# Altium schematic sheet Microcontroller.SchDoc
size A
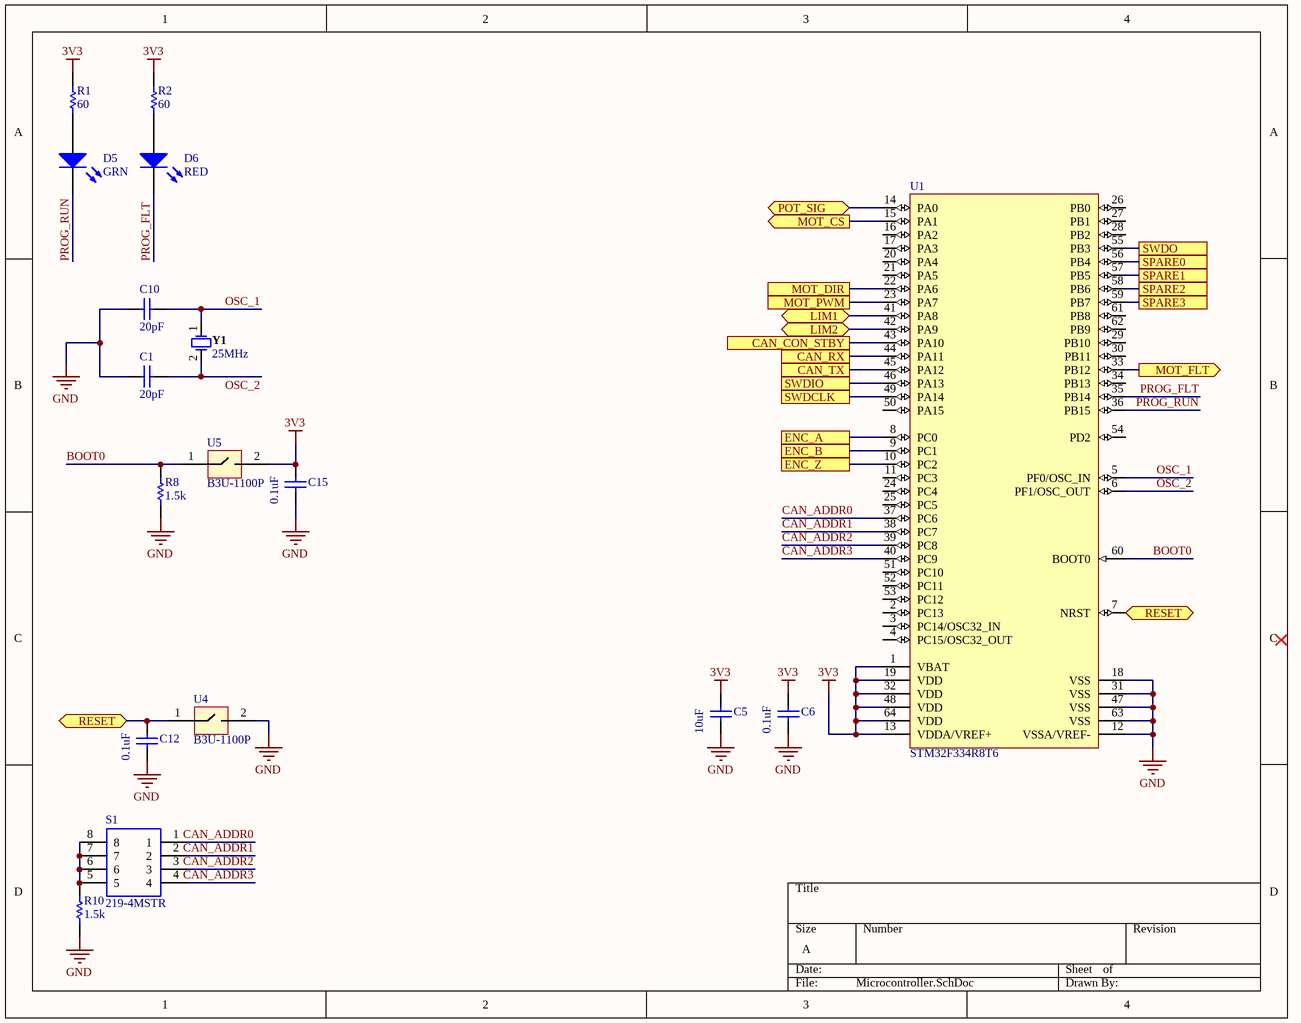
[diagram p0: Microcontroller.SchDoc]

## Parts
C1  value 20pF  [RESC2013X60X35LL10T20]  (hidden comment: Cap Semi)
C5  value 10uF  [RESC2013X60X35LL10T20]  (hidden comment: Cap Semi)
C6  value 0.1uF  [RESC2013X60X35LL10T20]  (hidden comment: Cap Semi)
C10  value 20pF  [RESC2013X60X35LL10T20]  (hidden comment: Cap Semi)
C12  value 0.1uF  [RESC2013X60X35LL10T20]  (hidden comment: Cap Semi)
C15  value 0.1uF  [RESC2013X60X35LL10T20]  (hidden comment: Cap Semi)
D5  GRN  [LED]
D6  RED  [LED]
R1  60  [RESC2013X60X35LL10T20]
R2  60  [RESC2013X60X35LL10T20]
R8  1.5k  [RESC2013X60X35LL10T20]
R10  1.5k  [RESC2013X60X35LL10T20]
S1  219-4MSTR  [SOP254P991X385-8N]
U1  STM32F334R8T6  [STM-LQFP64_L]
U4  B3U-1100P  [B3U-1100P - duplicate]
U5  B3U-1100P  [B3U-1100P - duplicate]
Y1  25MHz  [ADAI-THHF-49S3]

## Ports
CAN_CON_STBY, CAN_RX, CAN_TX, ENC_A, ENC_B, ENC_Z, LIM1 (bidir), LIM2 (bidir), MOT_CS (out), MOT_DIR, MOT_FLT (out), MOT_PWM, POT_SIG (bidir), RESET (bidir), SPARE0, SPARE1, SPARE2, SPARE3, SWDCLK, SWDIO, SWDO

## Nets
3V3: C5.2 C6.2 C15.2 R1.2 R2.2 U1.1(VBAT) U1.13(VDDA/VREF+) U1.19(VDD) U1.32(VDD) U1.48(VDD) U1.64(VDD) U5.2(NO_PUSH)
GND: C1.2 C5.1 C6.1 C10.2 C12.1 C15.1 R8.1 R10.1 U1.12(VSSA/VREF-) U1.18(VSS) U1.31(VSS) U1.47(VSS) U1.63(VSS) U4.2(NO_PUSH)
BOOT0: R8.2 U1.60(BOOT0) U5.1
CAN_ADDR0: S1.1 U1.37(PC6)
CAN_ADDR1: S1.2 U1.38(PC7)
CAN_ADDR2: S1.3 U1.39(PC8)
CAN_ADDR3: S1.4 U1.40(PC9)
CAN_CON_STBY: U1.43(PA10) ; port CAN_CON_STBY
CAN_RX: U1.44(PA11) ; port CAN_RX
CAN_TX: U1.45(PA12) ; port CAN_TX
ENC_A: U1.8(PC0) ; port ENC_A
ENC_B: U1.9(PC1) ; port ENC_B
ENC_Z: U1.10(PC2) ; port ENC_Z
LIM1: U1.41(PA8) ; port LIM1
LIM2: U1.42(PA9) ; port LIM2
MOT_CS: U1.15(PA1) ; port MOT_CS
MOT_DIR: U1.22(PA6) ; port MOT_DIR
MOT_FLT: U1.33(PB12) ; port MOT_FLT
MOT_PWM: U1.23(PA7) ; port MOT_PWM
OSC_1: C10.1 U1.5(PF0/OSC_IN) Y1.1
OSC_2: C1.1 U1.6(PF1/OSC_OUT) Y1.2
POT_SIG: U1.14(PA0) ; port POT_SIG
PROG_FLT: D6.2(K) U1.35(PB14)
PROG_RUN: D5.2(K) U1.36(PB15)
RESET: C12.2 U1.7(NRST) U4.1 ; port RESET
SPARE0: U1.56(PB4) ; port SPARE0
SPARE1: U1.57(PB5) ; port SPARE1
SPARE2: U1.58(PB6) ; port SPARE2
SPARE3: U1.59(PB7) ; port SPARE3
SWDCLK: U1.49(PA14) ; port SWDCLK
SWDIO: U1.46(PA13) ; port SWDIO
SWDO: U1.55(PB3) ; port SWDO
NetD5_1: D5.1(A) R1.1
NetD6_1: D6.1(A) R2.1
NetR10_2: R10.2 S1.5 S1.6 S1.7 S1.8

Not connected (* = marked no-connect by the designer): U1 2(PC13) 3(PC14/OSC32_IN) 4(PC15/OSC32_OUT) 11(PC3) 16(PA2) 17(PA3) 20(PA4) 21(PA5) 24(PC4) 25(PC5) 26(PB0) 27(PB1) 28(PB2) 29(PB10) 30(PB11) 34(PB13) 50(PA15) 51(PC10) 52(PC11) 53(PC12) 54(PD2) 61(PB8) 62(PB9)

## Library data of the parts
C1 C5 C6 C10 C12 C15 = Cap Semi: Capacitor (Semiconductor SIM Model); Published: 8-Jun-2000; LatestRevisionDate: 29-May-2009; LatestRevisionNote: IPC-7351 Footprint Added.; PackageReference: C1206; Publisher: Altium Limited; PackageDescription: Chip Capacitor
D5 D6 = LED0: Typical INFRARED GaAs LED; Published: 8-Jun-2000; LatestRevisionDate: 08-Jul-2005; LatestRevisionNote: Mech Layer 1 removed.; PackageReference: LED-0; Publisher: Altium Limited; PackageDescription: LED; 2 Leads
R1 R2 R8 R10 = RES-2
S1 = 219-4MSTR: DIP Switches / SIP Switches SPST 4 switch sections; Manufacturer_Name: CTS; Geometry.Height: 3.85mm; Manufacturer_Part_Number: 219-4MSTR; RS Part Number: 1774368; RS Price/Stock: http://uk.rs-online.com/web/p/products/1774368; Arrow Part Number: 219-4MSTR; Arrow Price/Stock: https://www.arrow.com/en/products/219-4mstr/cts; Datasheet Link: https://www.ctscorp.com/wp-content/uploads/219.pdf
U1 = CMP-0537-00077-1: ARM Cortex-M4 32-bit MCU, 64 KB Flash, 16 KB Internal RAM, 51 I/Os, 64-Pin LQFP, -40 to 85 degC, Tray; Supply Voltage(Vcc) min (V): 2; D/A Converter: 3; Internal RAM Size (kB): 16; FLASH Size (Prog) (kB): 64; Operating Frequency(F) (Processor speed) (MHz): 72; I/Os (High Current): 51; ComponentLink1Description: Manufacturer URL; ComponentLink2URL: http://www.st.com/st-web-ui/static/active/en/resource/technical/document/datasheet/DM00097745.pdf; Package Reference: LQFP64; ComponentLink1URL: http://www.st.com/; ComponentLink2Description: Datasheet; DatasheetVersion: Rev. 4; Mounting Technology: Surface Mount; Package Description: 64-Pin Low-profile Quad Flat Package, Body 10 x 10 mm, Pitch 0.5 mm; Packing: Tray; Core: ARM Cortex-M4
Y1 = CMP-1740-00004-1: Elements: 1; Max Dual Supply Voltage: 15 V; Propagation Delay: 115 ns; Nominal Dual Supply Voltage: 12 V; Case\Package: PDIP; Min Supply Voltage: 3.5 V; Min Dual Supply Voltage: 1.75 V; Nominal Voltage Gain: 106.02 dB; Nominal Supply Current: 7.5 mA; Max Supply Voltage: 30 V; PackageDescription: 2-Pin Through Hole Device, Body 11.05 x 4.65 mm, Pitch 4.88 mm; Length: 9.81 mm; ComponentLink2URL: https://cdn-shop.adafruit.com/product-files/2214/2214datasheet.pdf; REACH SVHC: No SVHC; PackageReference: THHF-49S3; DatasheetVersion: Nov-14; ComponentLink1URL: https://www.adafruit.com/; Height: 4.57 mm; Width: 6.35 mm; Channels: 1; ComponentLink2Description: Datasheet; Max Operating Temperature: 70 degC; Packaging: Rail/Tube; Nominal Supply Voltage: 12 V; Weight: 0.015535 oz; Package Quantity: 50; RoHSCompliant: true; Radiation Hardening: No; Pins: 8; ComponentLink1Description: Manufacturer URL; Min Operating Temperature: 0 degC; Mount: Through Hole